# EAGLE design rfm26w_breakout_board (EAGLE 7.2.0)
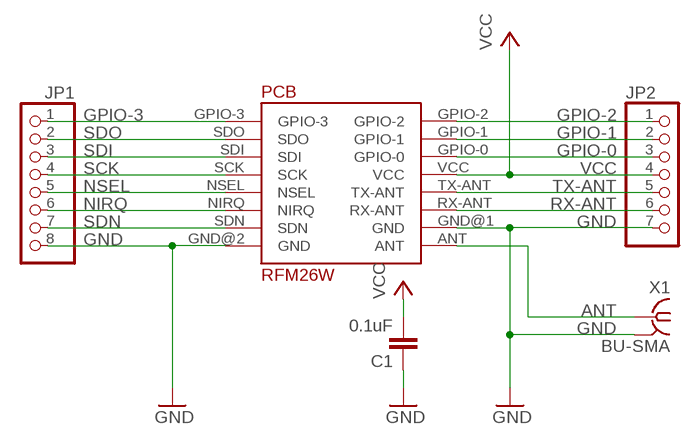
[diagram p0: schematic, sheet 1]

## Parts
C1  0.1uF  C-EUC0805K  [C0805K]
JP1  PINHD-1X8  [1X08]
JP2  PINHD-1X7  [1X07]
PCB  RFM26W  [RFM26W]
X1  BU-SMA  BU-SMA-V  [BU-SMA-V]

## Nets
ANT: PCB.ANT X1.1
GND: C1.1 JP1.8 JP2.7 PCB.GND@1(GND) PCB.GND@2(GND) X1.2 X1.3 X1.4 X1.5
GPIO-0: JP2.3 PCB.GPIO-0
GPIO-1: JP2.2 PCB.GPIO-1
GPIO-2: JP2.1 PCB.GPIO-2
GPIO-3: JP1.1 PCB.GPIO-3
NIRQ: JP1.6 PCB.NIRQ
NSEL: JP1.5 PCB.NSEL
RX-ANT: JP2.6 PCB.RX-ANT
SCK: JP1.4 PCB.SCK
SDI: JP1.3 PCB.SDI
SDN: JP1.7 PCB.SDN
SDO: JP1.2 PCB.SDO
TX-ANT: JP2.5 PCB.TX-ANT
VCC: C1.2 JP2.4 PCB.VCC

## Library data of the parts
C1 = rcl:C-EU: CAPACITOR, European symbol
JP1 = pinhead:PINHD-1X8: PIN HEADER
JP2 = pinhead:PINHD-1X7: PIN HEADER
PCB = KaiBader:RFM26W: RFM26W ISM Transceiver module.
X1 = con-coax:BU-SMA-V: FEMALE SMA CONNECTOR Radiall distributor RS 112-3794; OC_FARNELL: unknown; OC_NEWARK: unknown

## Board
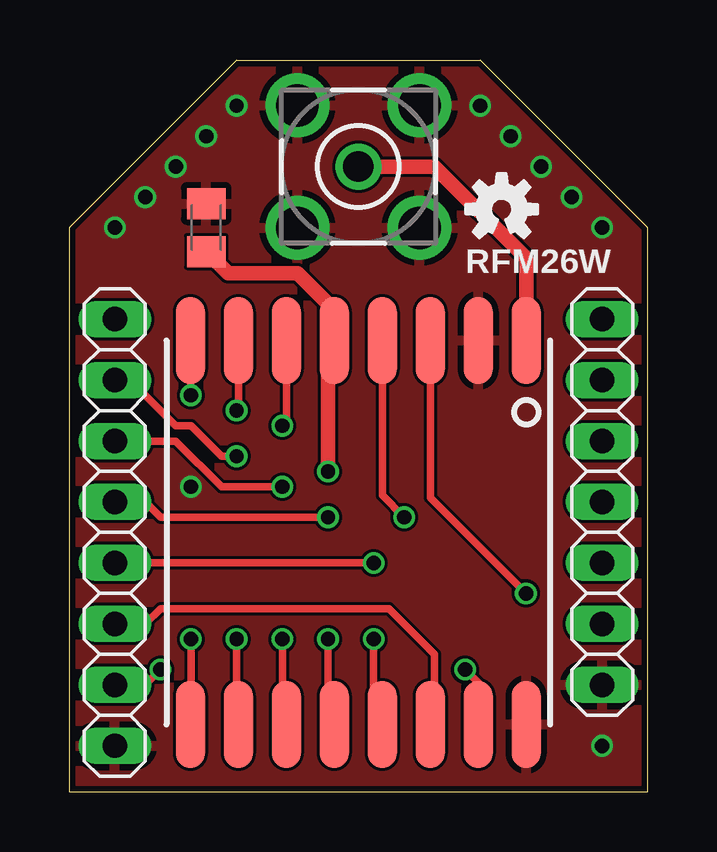
[diagram p1: board, top side]
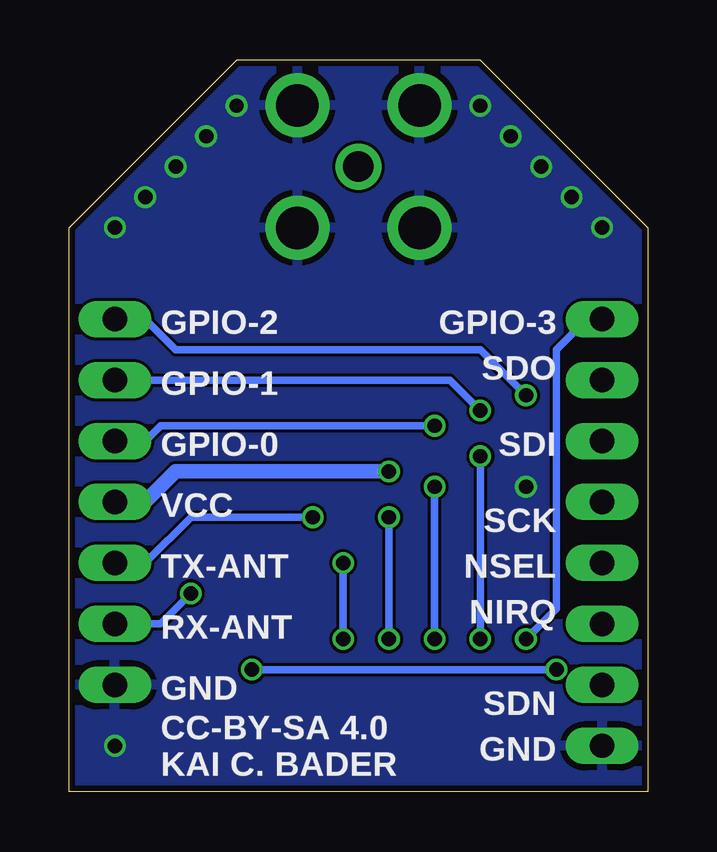
[diagram p2: board, bottom side, seen from below]

Size 24.13 x 30.48 mm. Coordinates in mm from the lower left corner, seen from the top.
Outline: 0,0 24.13,0 24.13,23.5 17.14,30.48 6.99,30.48 0,23.5 0,0
Copper layers (1*16): Top 0.035mm / dielectric 1.5mm / Bottom 0.035mm
Design rules "dirt_cheap_dirty_boards.v1": minimum track width 5mil, minimum drill 12mil, track to track 5mil, track to pad 5mil, pad to pad 5mil, via to via 5mil, smd to smd 0mil, copper to edge 10mil, drill to drill 10mil, minimum pad ring 10mil, minimum via ring 6mil, stop-mask expansion 2mil, vias tented up to drill 25mil, thermal gap 10mil

### Footprints (pad centres in the part's own frame; a part is rotated, then mirrored left to right if it is on the bottom)
C0805K = smd 1.3 x 1.6: 1 -1,0; 2 1,0
1X08 = drill 1.016 long: 1 -8.89,0; 2 -6.35,0; 3 -3.81,0; 4 -1.27,0; 5 1.27,0; 6 3.81,0; 7 6.35,0; 8 8.89,0
1X07 = drill 1.016 long: 1 -7.62,0; 2 -5.08,0; 3 -2.54,0; 4 0,0; 5 2.54,0; 6 5.08,0; 7 7.62,0
RFM26W = smd 1.2 x 3.6: ANT 7,8; GND@1 5,8; GND@2 7,-8; GPIO-0 -3,8; GPIO-1 -5,8; GPIO-2 -7,8; GPIO-3 -7,-8; NIRQ 3,-8; NSEL 1,-8; RX-ANT 3,8; SCK -1,-8; SDI -3,-8; SDN 5,-8; SDO -5,-8; TX-ANT 1,8; VCC -1,8
BU-SMA-V = drill 1.27: 1 0,0 | drill 1.778: 2 -2.55,2.55; 3 2.55,2.55; 4 2.55,-2.55; 5 -2.55,-2.55

### Placement (x,y rotation side)
C1  5.71,23.5 270 top
JP1  1.91,10.79 270 top
JP2  22.23,12.06 270 top
PCB  12.06,10.79 0 top
U$3  [OSHW-LOGO-S]  18.03,24.26 0 top
X1  12.06,26.04 0 top

### Tracks (layer width: path | path; a pad name or v marks a point on that pad's centre or on a via)
ANT
  Top 0.61: PCB.ANT 19.07,22.21 15.24,26.04 X1.1
GND  (via drill 0.6)
  other vias: 17.14,28.57 18.41,27.3 19.68,26.04 20.95,24.77 22.23,23.5 6.99,28.57 5.71,27.3 4.45,26.04 3.17,24.77 1.91,23.5 5.08,12.7 22.23,1.91
  pour Bottom: 0,0 24.13,0 24.13,30.48 0,30.48
  pour Top: 0,0 24.13,0 24.13,30.48 0,30.48
GPIO-0  (via drill 0.6)
  Top 0.305: PCB.GPIO-0 9.06,15.41 v8.89,15.24
  Bottom 0.305: v8.89,15.24 20.32,15.24 20.95,14.61 JP2.3
GPIO-1  (via drill 0.6)
  Top 0.305: PCB.GPIO-1 7.07,15.96 v6.99,15.88
  Bottom 0.305: v6.99,15.88 8.26,17.14 JP2.2
GPIO-2  (via drill 0.6)
  Top 0.305: PCB.GPIO-2 5.07,17.16 v5.08,16.51
  Bottom 0.305: v5.08,16.51 6.99,18.41 19.68,18.41 20.95,19.68 JP2.1
GPIO-3  (via drill 0.6)
  Top 0.305: v5.08,6.35 5.08,2.81 PCB.GPIO-3
  Bottom 0.305: JP1.1 2.54,19.68 3.81,18.41 3.81,7.62 v5.08,6.35
NIRQ
  Top 0.305: JP1.6 3.17,6.99 3.81,7.62 13.34,7.62 15.24,5.71 15.24,2.97 PCB.NIRQ
NSEL  (via drill 0.6)
  Top 0.305: JP1.5 v12.7,9.53 | v12.7,6.35 12.7,3.16 PCB.NSEL
  Bottom 0.305: v12.7,9.53 v12.7,6.35
RX-ANT  (via drill 0.6)
  Top 0.305: PCB.RX-ANT 15.06,12.24 v19.05,8.26
  Bottom 0.305: v19.05,8.26 20.32,6.99 JP2.6
SCK  (via drill 0.6)
  Top 0.305: JP1.4 3.17,12.06 3.81,11.43 v10.79,11.43 | v10.79,6.35 10.79,3.06 PCB.SCK
  Bottom 0.305: v10.79,11.43 v10.79,6.35
SDI  (via drill 0.6)
  Top 0.305: JP1.3 4.45,14.61 6.35,12.7 v8.89,12.7 | v8.89,6.35 8.89,2.97 PCB.SDI
  Bottom 0.305: v8.89,12.7 v8.89,6.35
SDN  (via drill 0.6)
  Top 0.305: JP1.7 3.17,4.45 v3.81,5.08 | v16.51,5.08 17.14,4.45 17.14,2.88 PCB.SDN
  Bottom 0.305: v3.81,5.08 v16.51,5.08
SDO  (via drill 0.6)
  Top 0.305: v6.99,6.35 6.99,2.88 PCB.SDO | v6.99,13.97 6.35,13.97 5.08,15.24 4.45,15.24 2.54,17.14 JP1.2
  Bottom 0.305: v6.99,13.97 v6.99,6.35
TX-ANT  (via drill 0.6)
  Top 0.305: PCB.TX-ANT 13.06,12.34 v13.97,11.43
  Bottom 0.305: v13.97,11.43 19.05,11.43 20.95,9.53 JP2.5
VCC  (via drill 0.6)
  Top 0.305: 11.06,20.05 PCB.VCC 10.79,18.8
  Top 0.61: 11.06,20.05 9.53,21.59 6.62,21.59 C1.2 | 10.79,18.8 v10.79,13.34
  Bottom 0.61: v10.79,13.34 19.68,13.34 20.95,12.06 JP2.4

### Text on the board
tPlace: RFM26W
bPlace: GPIO-3 | GPIO-2 | SDO | GPIO-1 | SDI | GPIO-0 | SCK | VCC | NSEL | TX-ANT | NIRQ | RX-ANT | GND | SDN | GND | CC-BY-SA 4.0 / KAI C. BADER